# Altium schematic sheet NodeMCU.SchDoc
size A4; Engineer: Naif Aljohani; DocumentNumber: 5; Revision: v1.0; SheetNumber: 5; SheetTotal: 7
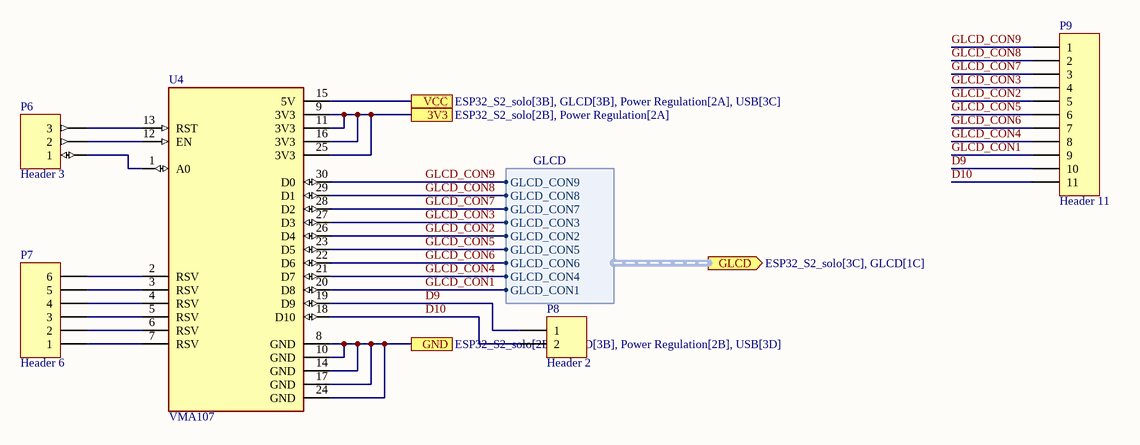
[diagram p0: NodeMCU.SchDoc]

## Parts
P6  Header 3  [HDR1X3]
P7  Header 6  [HDR1X6]
P8  Header 2  [HDR1X2]
P9  Header 11  [HDR1X11]
U4  VMA107  [MODULE_VMA107]

## Ports
3V3 (see ESP32_S2_solo[2B], Power Regulation[2A]), GLCD (out, harness GLCD, see ESP32_S2_solo[3C], GLCD[1C]), GND (see ESP32_S2_solo[2D], GLCD[3B], Power Regulation[2B], USB[3D]), VCC (see ESP32_S2_solo[3B], GLCD[3B], Power Regulation[2A], USB[3C])

## Harnesses
GLCD: GLCD_CON1, GLCD_CON2, GLCD_CON3, GLCD_CON4, GLCD_CON5, GLCD_CON6, GLCD_CON7, GLCD_CON8, GLCD_CON9

## Nets
3V3: U4.9(3V3) U4.11(3V3) U4.16(3V3) U4.25(3V3) ; port 3V3
D9: P8.1 P9.10 U4.19(D9)
D10: P8.2 P9.11 U4.18(D10)
GLCD_CON1: P9.9 U4.20(D8) ; port GLCD.GLCD_CON1
GLCD_CON2: P9.5 U4.26(D4) ; port GLCD.GLCD_CON2
GLCD_CON3: P9.4 U4.27(D3) ; port GLCD.GLCD_CON3
GLCD_CON4: P9.8 U4.21(D7) ; port GLCD.GLCD_CON4
GLCD_CON5: P9.6 U4.23(D5) ; port GLCD.GLCD_CON5
GLCD_CON6: P9.7 U4.22(D6) ; port GLCD.GLCD_CON6
GLCD_CON7: P9.3 U4.28(D2) ; port GLCD.GLCD_CON7
GLCD_CON8: P9.2 U4.29(D1) ; port GLCD.GLCD_CON8
GLCD_CON9: P9.1 U4.30(D0) ; port GLCD.GLCD_CON9
GND: U4.8(GND) U4.10(GND) U4.14(GND) U4.17(GND) U4.24(GND) ; port GND
VCC: U4.15(5V) ; port VCC
NetP6_1: P6.1 U4.1(A0)
NetP6_2: P6.2 U4.12(EN)
NetP6_3: P6.3 U4.13(RST)
NetP7_1: P7.1 U4.7(RSV)
NetP7_2: P7.2 U4.6(RSV)
NetP7_3: P7.3 U4.5(RSV)
NetP7_4: P7.4 U4.4(RSV)
NetP7_5: P7.5 U4.3(RSV)
NetP7_6: P7.6 U4.2(RSV)

## Library data of the parts
P6 = Header 3: Header, 3-Pin; LatestRevisionDate: 17-Jul-2002; LatestRevisionNote: Re-released for DXP Platform.; Publisher: Altium Limited
P7 = Header 6: Header, 6-Pin; LatestRevisionDate: 17-Jul-2002; LatestRevisionNote: Re-released for DXP Platform.; Publisher: Altium Limited
P8 = Header 2: Header, 2-Pin; LatestRevisionDate: 17-Jul-2002; LatestRevisionNote: Re-released for DXP Platform.; Publisher: Altium Limited
P9 = Header 11: Header, 11-Pin; LatestRevisionDate: 17-Jul-2002; LatestRevisionNote: Re-released for DXP Platform.; Publisher: Altium Limited
U4 = VMA107: NodeMCU V2 Lua Based ESP8266 Development Board; MF: {'manufacturer': u'Velleman'}; Package: None; Price: None; Value: *; MP: VMA107; Availability: Unavailable